# Altium schematic sheet Page3_POWER.SchDoc
size B
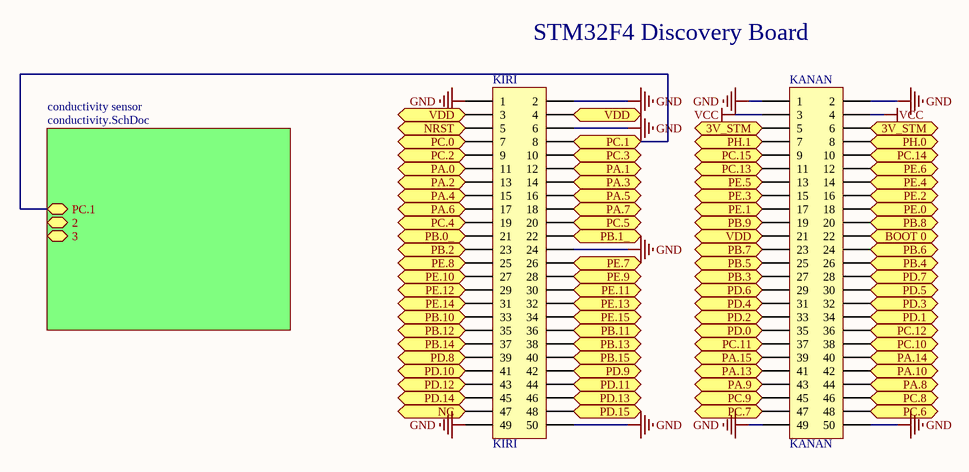
[diagram p0: Page3_POWER.SchDoc]

## Parts
KANAN  KANAN  [HDR2X25]
KIRI  KIRI  [HDR2X25]

## Sub-sheets
conductivity sensor = conductivity.SchDoc: PC.1, 2, 3

## Ports
3V_STM, BOOT 0, NC, NRST, PA.0, PA.1, PA.2, PA.3, PA.4, PA.5, PA.6, PA.7, PA.8, PA.9, PA.10, PA.13, PA.14, PA.15, PB.0_, PB.1_, PB.2, PB.3, PB.4, PB.5, PB.6, PB.7, PB.8, PB.9, PB.10, PB.11, PB.12, PB.13, PB.14, PB.15, PC.0, PC.1, PC.2, PC.3, PC.4, PC.5, PC.6, PC.7, PC.8, PC.9, PC.10, PC.11, PC.12, PC.13, PC.14, PC.15, PD.0, PD.1, PD.2, PD.3, PD.4, PD.5, PD.6, PD.7, PD.8, PD.9, PD.10, PD.11, PD.12, PD.13, PD.14, PD.15, PE.0, PE.1, PE.2, PE.3, PE.4, PE.5, PE.6, PE.7, PE.8, PE.9, PE.10, PE.11, PE.12, PE.13, PE.14, PE.15, PH.0, PH.1, VDD

## Nets
GND: KANAN.1 KANAN.2 KANAN.49 KANAN.50 KIRI.1 KIRI.2 KIRI.6 KIRI.24 KIRI.49 KIRI.50
VCC: KANAN.3 KANAN.4
3V_STM: KANAN.5 KANAN.6 ; port 3V_STM
BOOT 0: KANAN.22 ; port BOOT 0
NC: KIRI.47 ; port NC
NRST: KIRI.5 ; port NRST
PA.0: KIRI.11 ; port PA.0
PA.1: KIRI.12 ; port PA.1
PA.2: KIRI.13 ; port PA.2
PA.3: KIRI.14 ; port PA.3
PA.4: KIRI.15 ; port PA.4
PA.5: KIRI.16 ; port PA.5
PA.6: KIRI.17 ; port PA.6
PA.7: KIRI.18 ; port PA.7
PA.8: KANAN.44 ; port PA.8
PA.9: KANAN.43 ; port PA.9
PA.10: KANAN.42 ; port PA.10
PA.13: KANAN.41 ; port PA.13
PA.14: KANAN.40 ; port PA.14
PA.15: KANAN.39 ; port PA.15
PB.0_: KIRI.21 ; port PB.0_
PB.1_: KIRI.22 ; port PB.1_
PB.2: KIRI.23 ; port PB.2
PB.3: KANAN.27 ; port PB.3
PB.4: KANAN.26 ; port PB.4
PB.5: KANAN.25 ; port PB.5
PB.6: KANAN.24 ; port PB.6
PB.7: KANAN.23 ; port PB.7
PB.8: KANAN.20 ; port PB.8
PB.9: KANAN.19 ; port PB.9
PB.10: KIRI.33 ; port PB.10
PB.11: KIRI.36 ; port PB.11
PB.12: KIRI.35 ; port PB.12
PB.13: KIRI.38 ; port PB.13
PB.14: KIRI.37 ; port PB.14
PB.15: KIRI.40 ; port PB.15
PC.0: KIRI.7 ; port PC.0
PC.1: KIRI.8 ; port PC.1, sheet conductivity sensor/PC.1
PC.2: KIRI.9 ; port PC.2
PC.3: KIRI.10 ; port PC.3
PC.4: KIRI.19 ; port PC.4
PC.5: KIRI.20 ; port PC.5
PC.6: KANAN.48 ; port PC.6
PC.7: KANAN.47 ; port PC.7
PC.8: KANAN.46 ; port PC.8
PC.9: KANAN.45 ; port PC.9
PC.10: KANAN.38 ; port PC.10
PC.11: KANAN.37 ; port PC.11
PC.12: KANAN.36 ; port PC.12
PC.13: KANAN.11 ; port PC.13
PC.14: KANAN.10 ; port PC.14
PC.15: KANAN.9 ; port PC.15
PD.0: KANAN.35 ; port PD.0
PD.1: KANAN.34 ; port PD.1
PD.2: KANAN.33 ; port PD.2
PD.3: KANAN.32 ; port PD.3
PD.4: KANAN.31 ; port PD.4
PD.5: KANAN.30 ; port PD.5
PD.6: KANAN.29 ; port PD.6
PD.7: KANAN.28 ; port PD.7
PD.8: KIRI.39 ; port PD.8
PD.9: KIRI.42 ; port PD.9
PD.10: KIRI.41 ; port PD.10
PD.11: KIRI.44 ; port PD.11
PD.12: KIRI.43 ; port PD.12
PD.13: KIRI.46 ; port PD.13
PD.14: KIRI.45 ; port PD.14
PD.15: KIRI.48 ; port PD.15
PE.0: KANAN.18 ; port PE.0
PE.1: KANAN.17 ; port PE.1
PE.2: KANAN.16 ; port PE.2
PE.3: KANAN.15 ; port PE.3
PE.4: KANAN.14 ; port PE.4
PE.5: KANAN.13 ; port PE.5
PE.6: KANAN.12 ; port PE.6
PE.7: KIRI.26 ; port PE.7
PE.8: KIRI.25 ; port PE.8
PE.9: KIRI.28 ; port PE.9
PE.10: KIRI.27 ; port PE.10
PE.11: KIRI.30 ; port PE.11
PE.12: KIRI.29 ; port PE.12
PE.13: KIRI.32 ; port PE.13
PE.14: KIRI.31 ; port PE.14
PE.15: KIRI.34 ; port PE.15
PH.0: KANAN.8 ; port PH.0
PH.1: KANAN.7 ; port PH.1
VDD: KANAN.21 KIRI.3 KIRI.4 ; port VDD

## Notes on the sheet
- STM32F4 Discovery Board

## Library data of the parts
KANAN KIRI = Header 25X2: Header, 25-Pin, Dual row; LatestRevisionDate: 17-Jul-2002; LatestRevisionNote: Re-released for DXP Platform.; Publisher: Altium Limited